# EAGLE design Smart_Power_Bank (EAGLE 8.4.3)
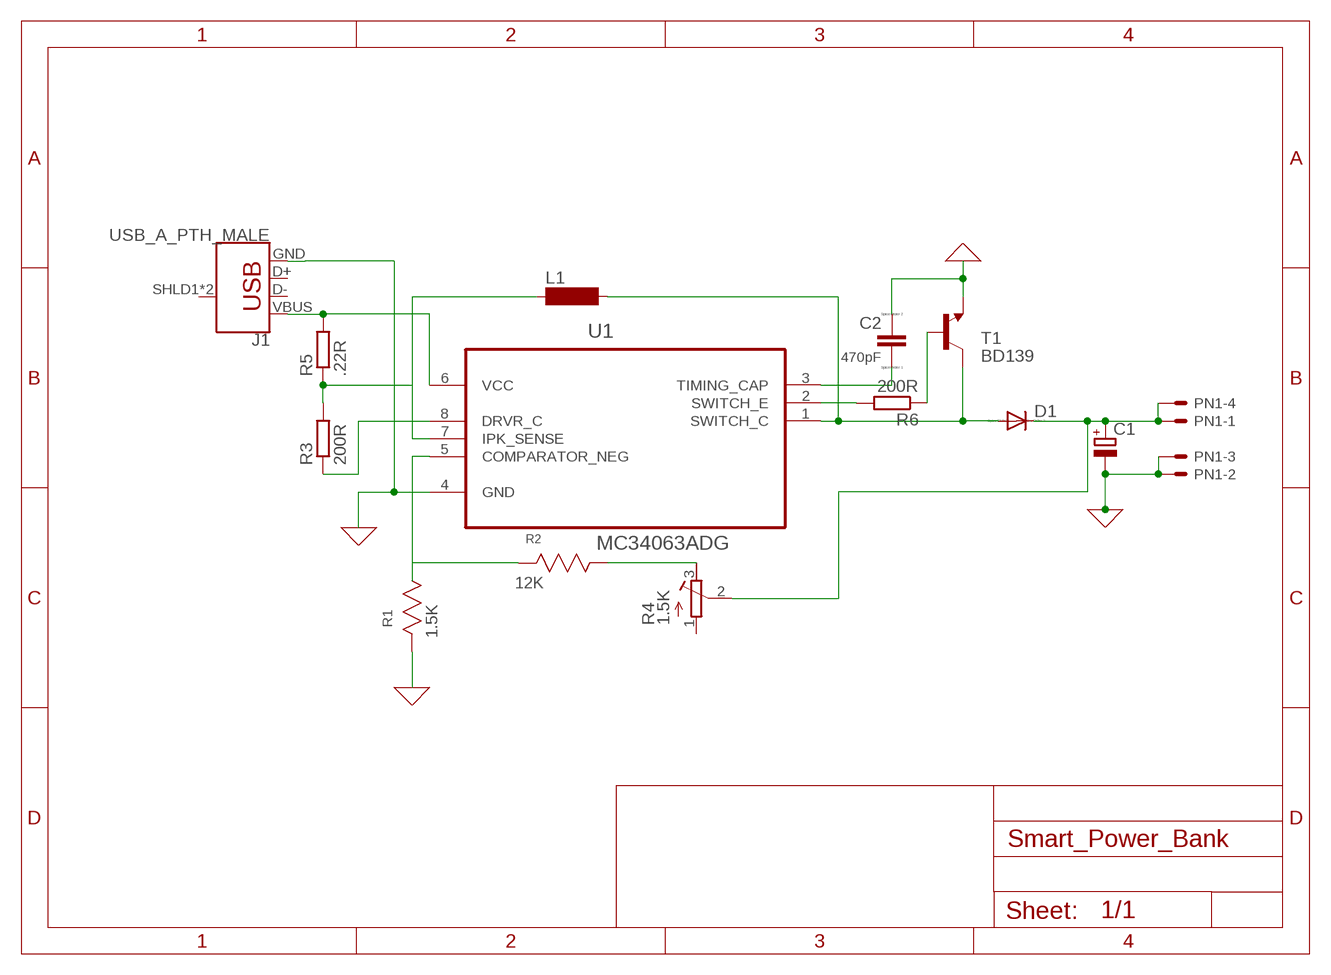
[diagram p0: schematic, sheet 1]

## Parts
C1  CPOL-EUTT2D6  [TT2D6]
C2  470pF  C  [C0805]
D1  DIODE-C1702-05  [C1702-05]
J1  USB_A_PTH_MALE  [USB-A-H]
L1  BS11  [BS11]
PN1  22-23-2041  [22-23-2041]
R1  1.5K  CRCW08053M16FKEA  [RESC2013X65N]
R2  12K  CRCW08053M16FKEA  [RESC2013X65N]
R3  200R  R-EU_R0805  [R0805]
R4  1.5K  R-TRIMM74X  [RTRIM74X]
R5  .22R  R-EU_0204/2V  [0204V]
R6  200R  R-EU_R0805  [R0805]
T1  BD139  [TO126]
U1  MC34063ADG  [SOIC127P600X175-8N]

## Nets
0: C1.- C2.2 J1.GND PN1.2 PN1.3 R1.2 T1.1(E) U1.4(GND) ; supply symbol labelled GND
N$1: J1.VBUS R5.2 U1.6(VCC)
N$3: D1.A L1.2 T1.2(C) U1.1(SWITCH_C)
N$4: R1.1 R2.2 U1.5(COMPARATOR_NEG)
N$5: R6.1 T1.3(B)
N$6: C1.+ D1.C PN1.1 PN1.4 R4.2(S)
N$8: R2.1 R4.3(E)
N$9: C2.1 U1.3(TIMING_CAP)
N$10: R3.1 U1.8(DRVR_C)
N$11: L1.1 R3.2 R5.1 U1.7(IPK_SENSE)
N$16: R6.2 U1.2(SWITCH_E)
Unconnected: J1.D+ J1.D- J1.SHLD1(SHIELD) J1.SHLD2(SHIELD) R4.1(A)

## Library data of the parts
C1 = resistor:CPOL-EU: POLARIZED CAPACITOR, European symbol
C2 = eagle-ltspice:C: CAPACITOR, European symbol; SPICEMODEL: NONE; SPICEPREFIX: C
D1 = diode:DIODE-: DIODE
J1 = SparkFun-Connectors:USB_A: USB-A Connector Male and female variants, as well as PTH and SMT variants SparkFun Products: SparkFun XBee Explorer Dongle <https://www.sparkfun.com/products/11697> PTH Male SparkFun MicroView-USB Programmer <https://www.sparkfun.com/products/12924> SMT Male SparkFun USB Type A Female Breakout <https://www.sparkfun.com/products/12700> SMT Female; PROD_ID: CONN-08367; SF_ID: PRT-00437
L1 = inductor-neosid:BS: INDUCTOR nominal inductance, magnetically screened; OC_FARNELL: unknown; OC_NEWARK: unknown
PN1 = con-molex:22-23-2041: .100" (2.54mm) Center Header - 4 Pin; MF: MOLEX; MPN: 22-23-2041; OC_FARNELL: 1462920; OC_NEWARK: 38C0355
R1 = Vishay_By_element14_Batch_1:CRCW08053M16FKEA: RESISTOR, 0805; MPN: CRCW08053M16FKEA; OC_FARNELL: -; OC_NEWARK: 53K0115; SUPPLIER: VISHAY DALE ELECTRONICS; TOLERANCE: ±1%; VALUE: 3.16M Ohms; WATTAGE: 0.125 W
R2 = Vishay_By_element14_Batch_1:CRCW08053M16FKEA: RESISTOR, 0805; MPN: CRCW08053M16FKEA; OC_FARNELL: -; OC_NEWARK: 53K0115; SPICEPREFIX: R; SUPPLIER: VISHAY DALE ELECTRONICS; TOLERANCE: ±1%; VALUE: 3.16M Ohms; WATTAGE: 0.125 W
R3 R5 R6 = rcl:R-EU_: RESISTOR, European symbol
R4 = rcl:R-TRIMM: Trimm resistor
T1 = transistor:BD139: NPN TRANSISTOR
U1 = ON Semiconductor_By_element14_Batch_1:MC34063ADG: Switching Regulators; MPN: MC34063ADG; OC_FARNELL: 1211119; OC_NEWARK: 45J1208; PACKAGE: SOIC-8; SUPPLIER: ON SEMICONDUCTOR

## Net classes
0 default: clearance 0.205 mm

## Board
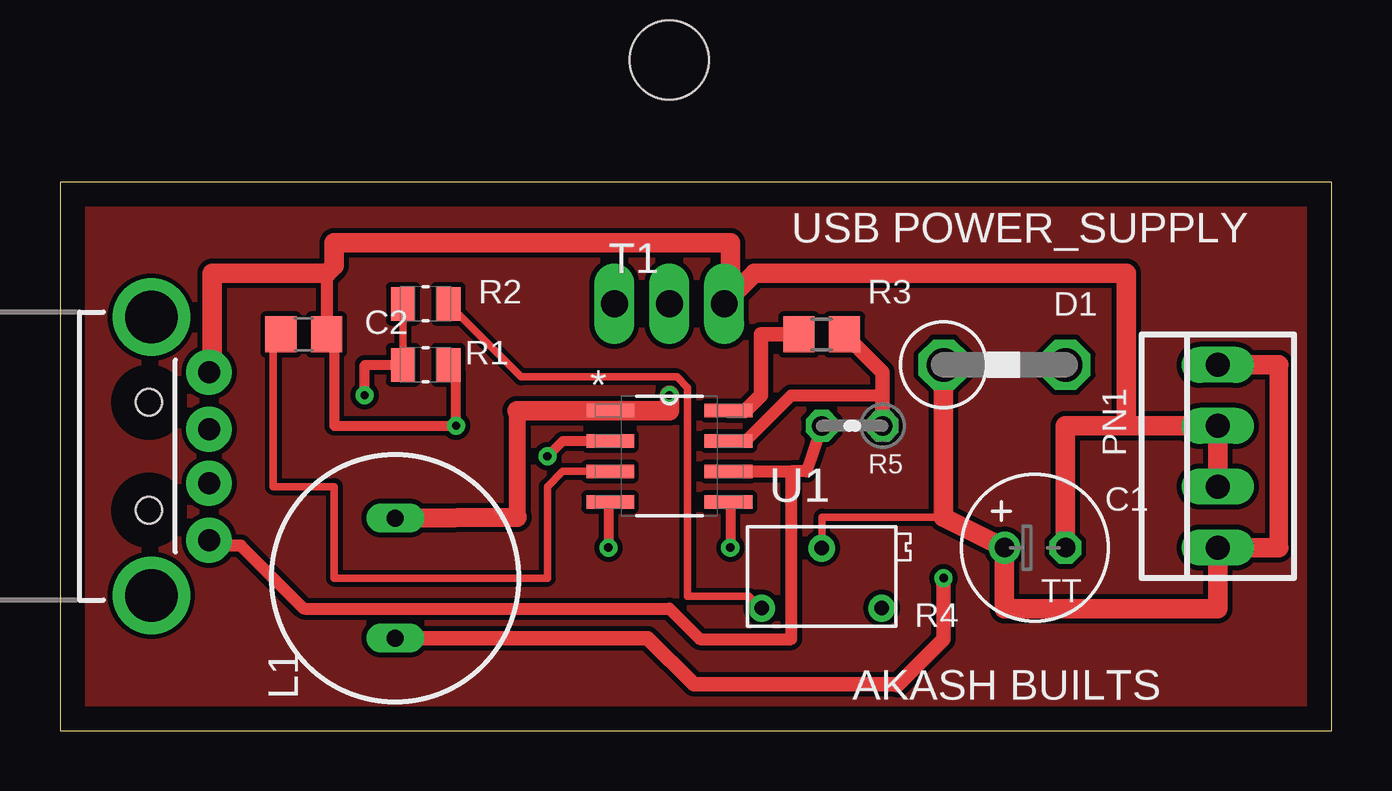
[diagram p1: board, top side]
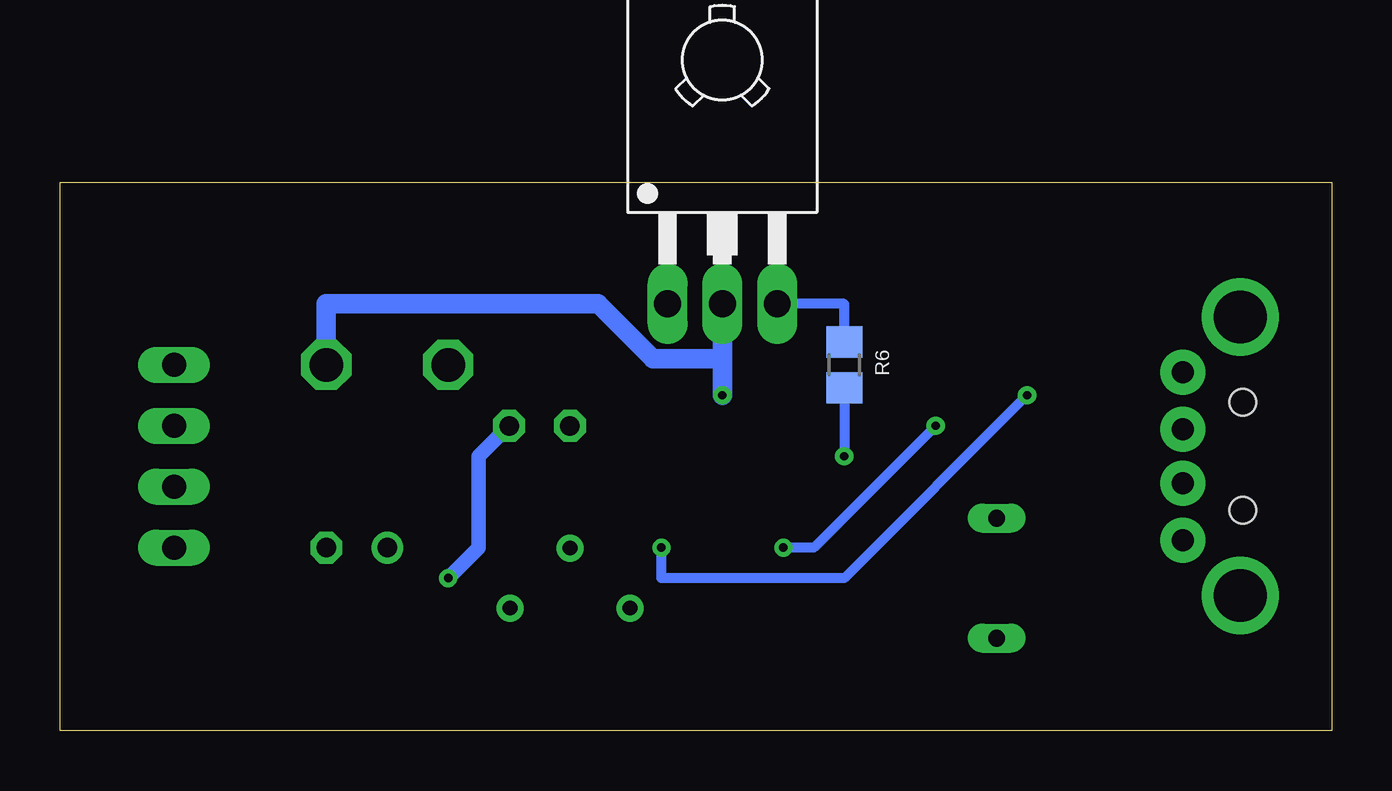
[diagram p2: board, bottom side, seen from below]

Size 53.01 x 22.85 mm. Coordinates in mm from the lower left corner, seen from the top.
Outline: 0,0 53.01,0 53.01,22.85 0,22.85 0,0
Copper layers (1*16): Top 0.035mm / dielectric 1.5mm / Bottom 0.035mm
Design rules "default": minimum track width 6mil, minimum drill 0.35mm, track to track 6mil, track to pad 6mil, pad to pad 6mil, via to via 6mil, smd to smd 6mil, copper to edge 40mil, drill to drill 6mil, minimum pad ring 10mil, minimum via ring 8mil, stop-mask expansion 4mil, vias tented up to drill 0mil, thermal gap 10mil

### Footprints (pad centres in the part's own frame; a part is rotated, then mirrored left to right if it is on the bottom)
TT2D6 = drill 0.813: + -1.27,0 | drill 0.813 octagon: - 1.27,0
C0805 = smd 1.3 x 1.5: 1 -0.95,0; 2 0.95,0
C1702-05 = drill 1.397 octagon: A 2.54,0; C -2.54,0
USB-A-H = drill 0.914 pad 1.88: D+ 2.4,1.127; D- 2.4,-1.127; GND 2.4,3.5; VBUS 2.4,-3.5 | drill 2.2: SHLD1 0,-5.8; SHLD2 0,5.8 | hole 1.1: -0.1,2.25; -0.1,-2.25
BS11 = drill 0.7 long: 1 -2.5,0; 2 2.5,0
22-23-2041 = drill 1 long: 1 -3.81,0; 2 -1.27,0; 3 1.27,0; 4 3.81,0
RESC2013X65N = smd 1.016 x 1.397: 1 -0.94,0; 2 0.94,0
R0805 = smd 1.3 x 1.5: 1 -0.95,0; 2 0.95,0
RTRIM74X = drill 0.61: 1 -1.25,-2.5; 2 1.25,0; 3 -1.25,2.5
0204V = drill 0.813 octagon: 1 -1.27,0; 2 1.27,0
TO126 = drill 1.118 long: 1 -2.286,-5.08; 2 0,-5.08; 3 2.286,-5.08 | hole 3.302: 0,5.08
SOIC127P600X175-8N = smd 1.981 x 0.559: 1 -2.464,1.905; 2 -2.464,0.635; 3 -2.464,-0.635; 4 -2.464,-1.905; 5 2.464,-1.905; 6 2.464,-0.635; 7 2.464,0.635; 8 2.464,1.905

### Placement (x,y rotation side)
C1  40.64,7.62 0 top
C2  10.16,16.51 0 top
D1  39.37,15.24 0 top
J1  3.81,11.43 0 top
L1  13.97,6.35 90 top
PN1  48.26,11.43 90 top
R1  15.24,15.24 0 top
R2  15.24,17.78 180 top
R3  31.75,16.51 0 top
R4  31.75,6.35 90 top
R5  33.02,12.7 180 top
R6  20.32,15.24 270 bottom
T1  25.4,22.86 0 bottom
U1  25.4,11.43 0 top

### Tracks (layer width: path | path; a pad name or v marks a point on that pad's centre or on a via)
0  (via drill 0.35)
  Top 0.406: U1.4 22.86,9.45 v22.86,7.62 | R1.2 16.51,14.91 v16.51,12.7 11.43,12.7 11.43,16.19 C2.2
  Top 0.508: 11.11,19.05 C2.2 | J1.GND 6.35,15.07
  Top 0.61: 27.94,18.03 T1.1
  Top 0.813: 44.45,12.7 PN1.3 PN1.2 | 44.45,12.7 41.91,12.7 C1.- | 6.35,15.07 6.35,19.05 11.11,19.05 11.43,19.37 11.43,20.32 27.94,20.32 27.94,18.03 | 44.45,12.7 44.45,19.05 28.96,19.05 T1.1
  Bottom 0.406: v16.51,12.7 21.59,7.62 v22.86,7.62
GND
  pour Top: 53.34,22.86 0,22.86 0,0 53.34,0
N$1
  Top 0.152: 6.43,7.7 J1.VBUS | 10.16,5.08 10.2,5.08
  Top 0.508: 6.21,7.62 J1.VBUS | 30.48,10.79 30.48,3.81 26.67,3.81 25.4,5.08 10.2,5.08 | R5.2 31.11,10.79 30.48,10.79 | U1.6 30.48,10.79 | 6.43,7.7 7.54,7.7 10.16,5.08
N$3  (via drill 0.35)
  Top 0.711: 19.05,13.34 19.05,8.89
  Top 0.813: 19.05,13.34 U1.1 25.4,13.34 v25.4,13.97 | 19.05,8.89 L1.2
  Bottom 0.813: T1.2 25.4,15.24 | 25.4,15.24 v25.4,13.97 | 25.4,15.24 25.65,15.49 28.29,15.49 30.57,17.78 41.91,17.78 D1.A
N$4  (via drill 0.35)
  Top 0.305: R1.1 R2.2
  Top 0.406: U1.5 27.94,9.45 v27.94,7.62 | v12.7,13.97 12.7,15.24 R1.1
  Bottom 0.406: v12.7,13.97 20.32,6.35 27.94,6.35 v27.94,7.62
N$5
  Bottom 0.406: R6.1 20.32,17.78 T1.3
N$6
  Top 0.305: R4.2 31.77,8.89 36.83,8.89
  Top 0.762: 50.8,15.24 50.8,7.62
  Top 0.813: D1.C 36.83,8.89 C1.+ 39.37,5.08 48.26,5.08 PN1.1 50.8,7.62 | PN1.4 50.8,15.24
N$8
  Top 0.305: R4.3 29.23,5.08 28.72,5.59 26.16,5.59 26.16,14.29 25.72,14.73 19.23,14.73 R2.1
N$9
  Top 0.305: C2.1 8.89,16.19 8.89,10.16 11.43,10.16 11.43,6.35 20.32,6.35 20.32,10.16 20.95,10.79 U1.3
N$10
  Top 0.61: U1.8 28.57,13.34 29.21,13.97 29.21,16.51 R3.1
N$11  (via drill 0.35)
  Top 0.305: 34.86,1.93 34.91,1.88
  Top 0.406: 28.57,12.06 U1.7
  Top 0.508: 34.29,13.97 30.48,13.97 28.57,12.06
  Top 0.61: R3.2 34.29,14.92 34.29,13.97 R5.1 | L1.1 24.5,3.85 26.42,1.93 34.86,1.93 | v36.83,6.35 36.83,3.81 34.91,1.88
  Bottom 0.61: R5.1 35.56,11.43 35.56,7.62 v36.83,6.35
N$16  (via drill 0.35)
  Top 0.406: U1.2 20.95,12.06 v20.32,11.43
  Bottom 0.406: R6.2 v20.32,11.43

### Text on the board
tNames: USB POWER_SUPPLY | AKASH BUILTS
bNames: राम